# Altium schematic sheet RJ45_Sheet.SchDoc
size 420 x 297 mm; SheetNumber: 6; SheetTotal: 32
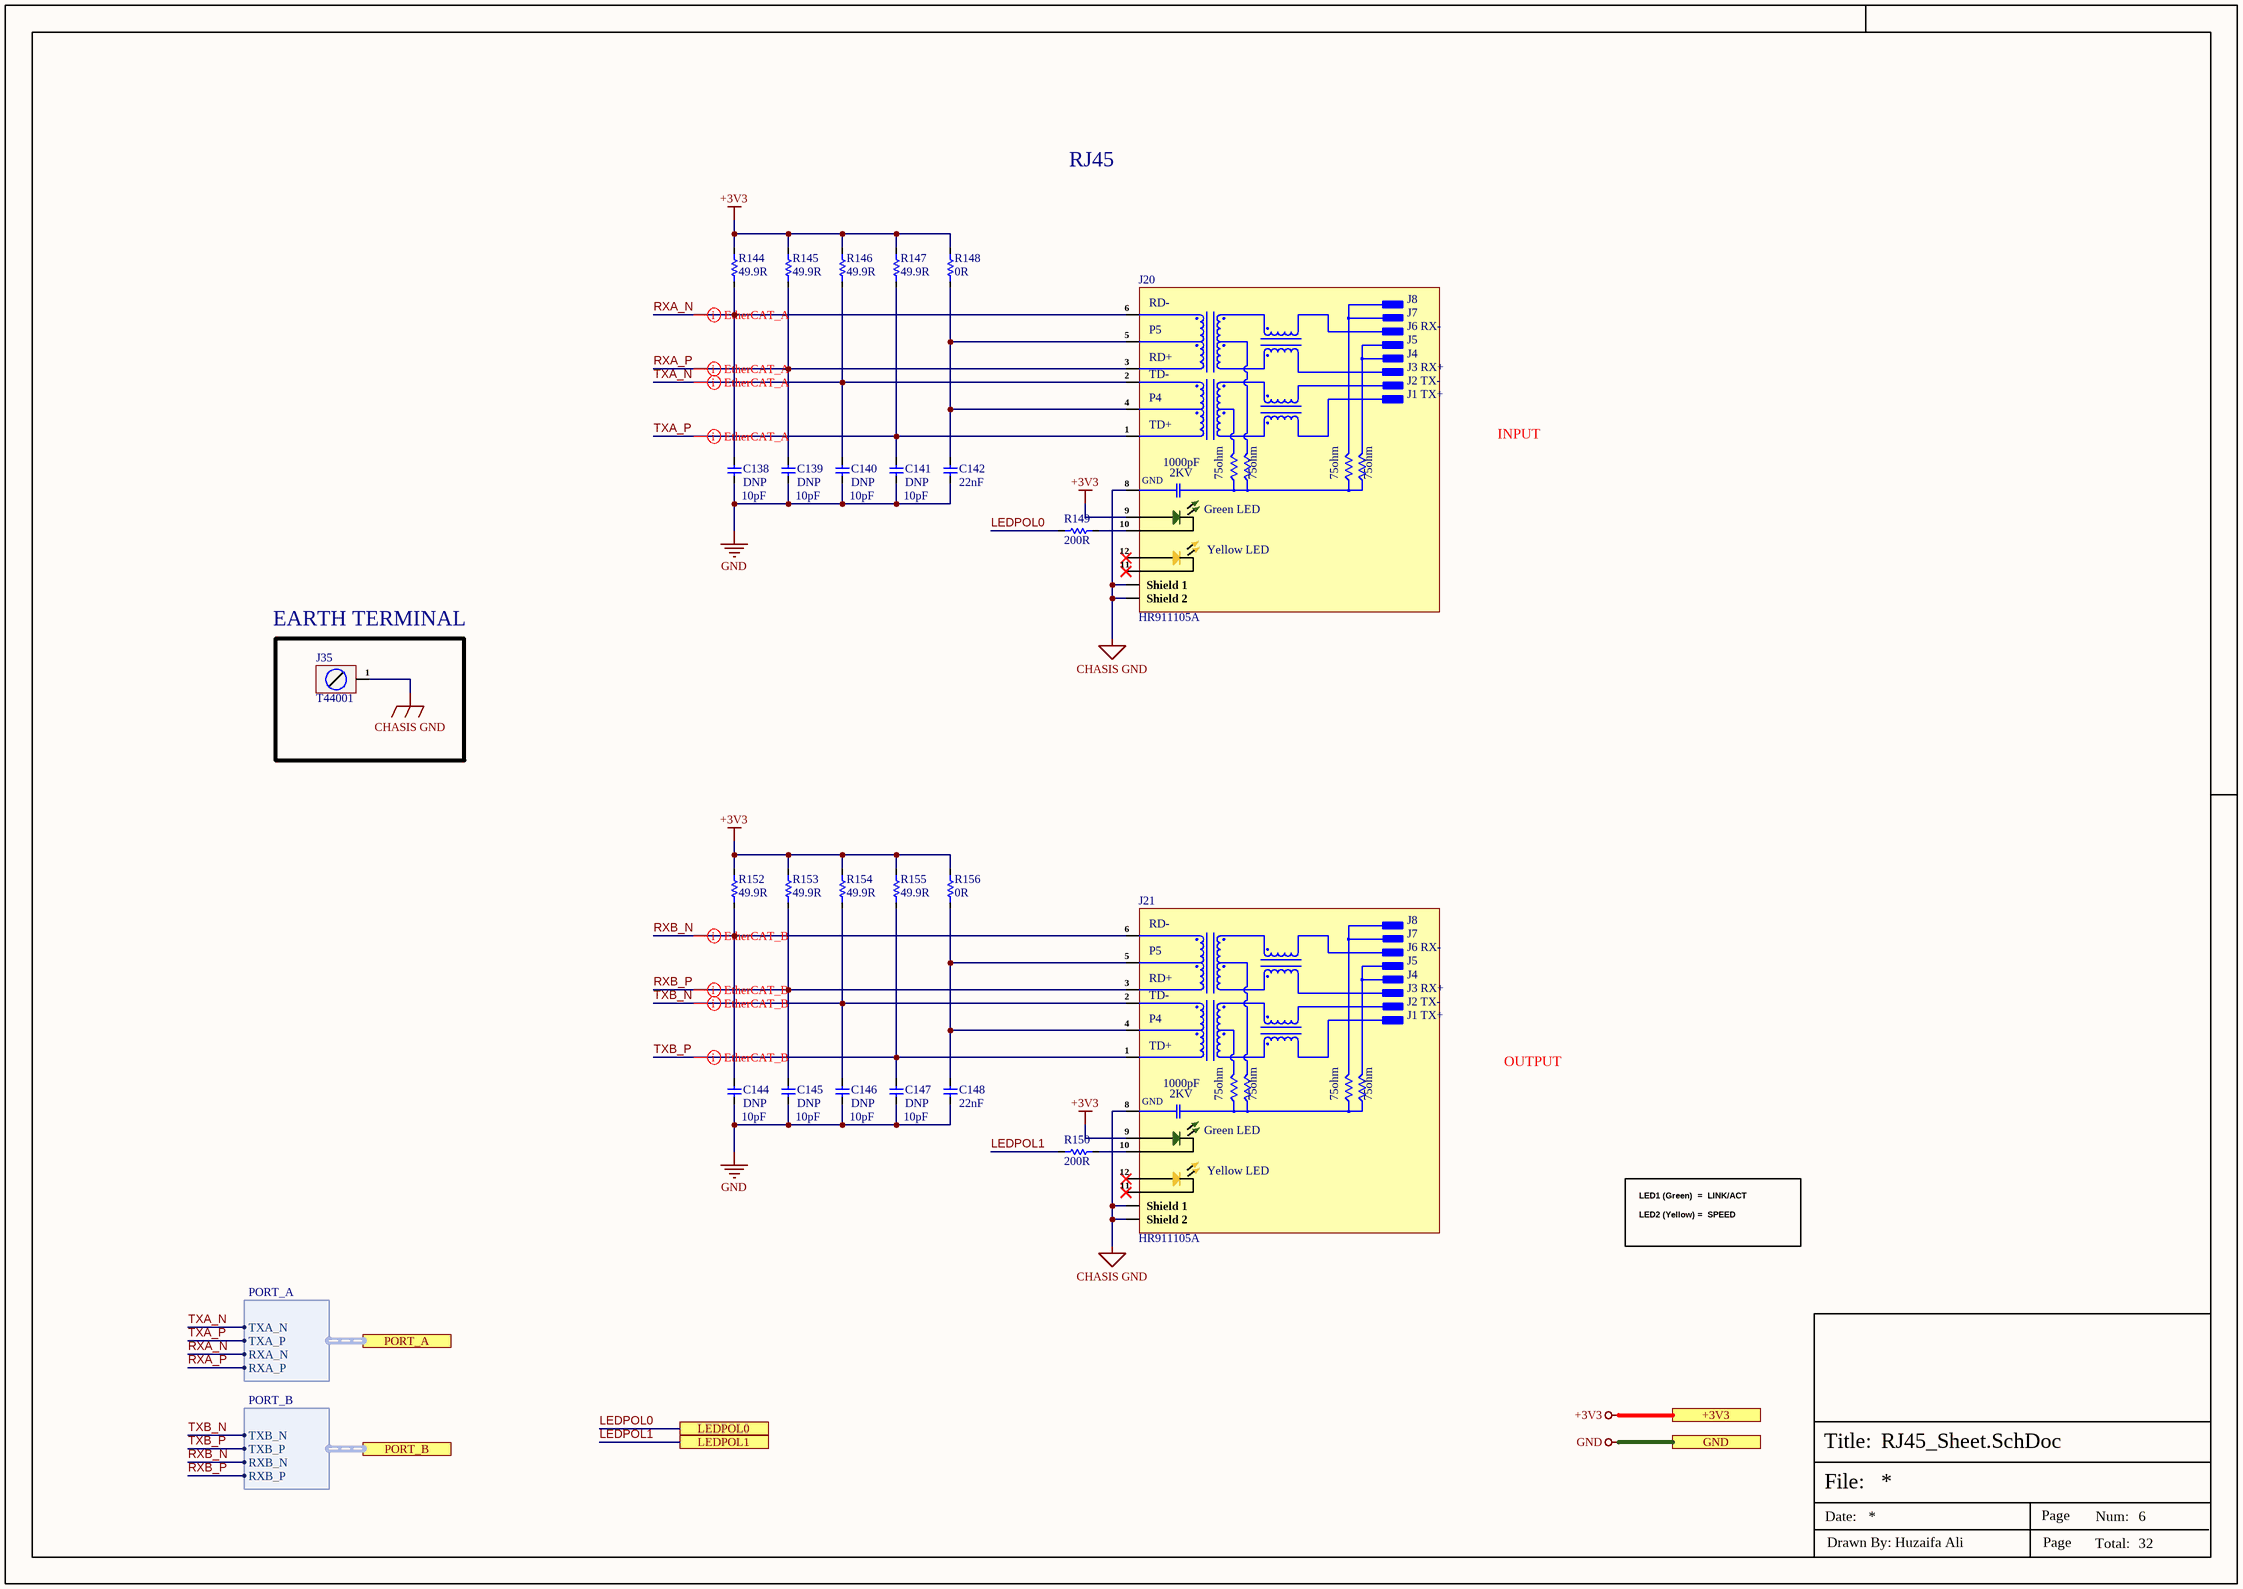
[diagram p0: RJ45_Sheet.SchDoc]

## Parts
C138  DNP  [Cap-0402]
C139  DNP  [Cap-0402]
C140  DNP  [Cap-0402]
C141  DNP  [Cap-0402]
C142  22nF  [Cap-0402]
C144  DNP  [Cap-0402]
C145  DNP  [Cap-0402]
C146  DNP  [Cap-0402]
C147  DNP  [Cap-0402]
C148  22nF  [Cap-0402]
J20  HR911105A  [HR911105A]
J21  HR911105A  [HR911105A]
J35  T44001  [T44001]
R144  49.9R  [Res-0603]
R145  49.9R  [Res-0603]
R146  49.9R  [Res-0603]
R147  49.9R  [Res-0603]
R148  0R  [Res-0402]
R149  200R  [Res-0402]
R150  200R  [Res-0402]
R152  49.9R  [Res-0603]
R153  49.9R  [Res-0603]
R154  49.9R  [Res-0603]
R155  49.9R  [Res-0603]
R156  0R  [Res-0402]

## Ports
+3V3 (see Top_Sheet[2C], CAN_Sheet[5D], Connector_Sheet[5D], Controller_Sheet[5D], Encoder_Sheet1[5D], Encoder_Sheet2[5D], Encoder_Sheet3[5D], Encoder_Sheet4[5D], EtherCAT_Sheet[5D], Motor_Driver_Sheet1[5D], Motor_Driver_Sheet2[5D], Motor_Driver_Sheet3[5D], Motor_Driver_Sheet4[5D], Power_Sheet[5D], RS485_RS232_Sheet[3D], Sec_Controller_Sheet1[5D], Sec_Controller_Sheet2[5D], Sec_Controller_Sheet3[5D], Sec_Controller_Sheet4[5D]), GND (see Top_Sheet[2C], CAN_Sheet[5D], Connector_Sheet[5D], Controller_Sheet[5D], DIO_1[5D], DIO_2[5D], DIO_3[5D], DIO_4[5D], Encoder_Sheet1[5D], Encoder_Sheet2[5D], Encoder_Sheet3[5D], Encoder_Sheet4[5D], EtherCAT_Sheet[5D], MOSFET_Driver_Sheet1[5D], MOSFET_Driver_Sheet2[5D], MOSFET_Driver_Sheet3[5D], MOSFET_Driver_Sheet4[5D], Motor_Driver_Sheet1[5D], Motor_Driver_Sheet2[5D], Motor_Driver_Sheet3[5D], Motor_Driver_Sheet4[5D], Power_Sheet[5D], RS485_RS232_Sheet[3D], Sec_Controller_Sheet1[5D], Sec_Controller_Sheet2[5D], Sec_Controller_Sheet3[5D], Sec_Controller_Sheet4[5D]), LEDPOL0 (see Top_Sheet[2D], EtherCAT_Sheet[1D]), LEDPOL1 (see Top_Sheet[2D], EtherCAT_Sheet[1D]), PORT_A (harness PORT_A, see Top_Sheet[2D], EtherCAT_Sheet[2D]), PORT_B (harness PORT_B, see Top_Sheet[2D], EtherCAT_Sheet[2D])

## Harnesses
PORT_A: TXA_N, TXA_P, RXA_N, RXA_P
PORT_B: TXB_N, TXB_P, RXB_N, RXB_P

## Nets
+3V3: J20.9(ANODE) J21.9(ANODE) R144.2 R145.2 R146.2 R147.2 R148.2 R152.2 R153.2 R154.2 R155.2 R156.2 ; port +3V3
CHASIS GND: J20.8(GND) J20.Shield_1 J20.Shield_2 J21.8(GND) J21.Shield_1 J21.Shield_2 J35.1
GND: C138.1 C139.1 C140.1 C141.1 C142.1 C144.1 C145.1 C146.1 C147.1 C148.1 ; port GND
LEDPOL0: R149.1 ; port LEDPOL0
LEDPOL1: R150.1 ; port LEDPOL1
RXA_N: C138.2 J20.6(RD-) R144.1 ; port PORT_A.RXA_N
RXA_P: C139.2 J20.3(RD+) R145.1 ; port PORT_A.RXA_P
RXB_N: C144.2 J21.6(RD-) R152.1 ; port PORT_B.RXB_N
RXB_P: C145.2 J21.3(RD+) R153.1 ; port PORT_B.RXB_P
TXA_N: C140.2 J20.2(TD-) R146.1 ; port PORT_A.TXA_N
TXA_P: C141.2 J20.1(TD+) R147.1 ; port PORT_A.TXA_P
TXB_N: C146.2 J21.2(TD-) R154.1 ; port PORT_B.TXB_N
TXB_P: C147.2 J21.1(TD+) R155.1 ; port PORT_B.TXB_P
NetC142_2: C142.2 J20.4(P4) J20.5(P5) R148.1
NetC148_2: C148.2 J21.4(P4) J21.5(P5) R156.1
NetJ20_10: J20.10(CATHODE) R149.2
NetJ21_10: J21.10(CATHODE) R150.2

Not connected (* = marked no-connect by the designer): J20 11(CATHODE)* 12(ANODE_)*; J21 11(CATHODE)* 12(ANODE_)*

## Layout directives
differential pair; differential pair class EtherCAT_B_Lines; net class EtherCAT_B; rule Matched Net Lengths [Tolerance = 25.4mil]; rule Impedance Constraint [Min = 85.00    Max = 95.00    ]: RXB_N, RXB_P, TXB_N, TXB_P
differential pair; differential pair class EtherCAT_A_Lines; net class EtherCAT_A; rule Matched Net Lengths [Tolerance = 25.4mil]; rule Impedance Constraint [Min = 85.00    Max = 95.00    ]: RXA_N, RXA_P, TXA_N, TXA_P

## Notes on the sheet
- RJ45
- INPUT
- 10pF
- (near J35) EARTH TERMINAL
- OUTPUT
- LED1 (Green)  =  LINK/ACT
  LED2 (Yellow) =  SPEED
- File:
- Title:
- Date:
- Page
- Num:
- Total:
- Drawn By: Huzaifa Ali
- (in symbol HR911105A) J8; J7; J6 RX-; J5; J4; J3 RX+; J2 TX-; J1 TX+; 1000pF; 2KV; 75ohm; Green LED; Yellow LED

## Library data of the parts
C138-C141 C144-C147 = GRM1555C1H100JA01D: CAP CER 10PF 50V C0G/NP0 0402; Manufacturer: Murata; Material: Ceramic; Dielectric: C0G; Tolerance: 5%; Item Type: Capacitor; Supplier: Arrow Electronics; Supplier Part Number: GRM1555C1H100JA01D; Manufacturer Part Number: GRM1555C1H100JA01D; RoHS: Yes; Category: Ceramic Capacitors; Stock: 3860000; Pricing: 10000=0.0034, 50000=0.0027, 100000=0.0023, 250000=0.0021 (USD); Mounting Technology: Surface Mount; Case/Package: 0402; Case Code (Metric): 1005; Case Code (Imperial): 0402; Min Operating Temperature: -55°C; Max Operating Temperature: 125°C; Value: 10pF; Voltage Rating: 50V; Packaging: Tape and Reel; Package Quantity: 1; Voltage Rating (DC): 50V; Termination: SMD/SMT; Series: GRM; Voltage: 50V; Construction: Flat; Length: 1mm; Width: 0.02inch; Height: 0.5mm; Depth: 0.5mm; Thickness: 0.022inch; Radiation Hardening: No; RoHS Compliant: Yes; Lead Free: Lead Free; Reach SVHC Compliant: No; ComponentLink1URL: https://datasheet.ciiva.com/2989/product-2989280.pdf?src-supplier=Avnet; ComponentLink1Description: https://datasheet.ciiva.com/2989/product-2989280.pdf?src-supplier=Avnet; ComponentLink2URL: https://datasheet.ciiva.com/18184/getdatasheetpartid-307234-18184164.pdf?src-supplier=Verical; ComponentLink2Description: https://datasheet.ciiva.com/18184/getdatasheetpartid-307234-18184164.pdf?src-supplier=Verical; ComponentLink3URL: https://datasheet.ciiva.com/29200/453545-da-01-en-vs-kondensator-0402-29200107.pdf?src-supplier=Conrad; ComponentLink3Description: https://datasheet.ciiva.com/29200/453545-da-01-en-vs-kondensator-0402-29200107.pdf?src-supplier=Conrad; ComponentLink4URL: https://datasheet.ciiva.com/7828/1666664-7828812.pdf?src-supplier=Element14; ComponentLink4Description: https://datasheet.ciiva.com/7828/1666664-7828812.pdf?src-supplier=Element14; ComponentLink5URL: https://datasheet.ciiva.com/6271/partnumbering-e-01-6271159.pdf?src-supplier=Digi-Key; ComponentLink5Description: https://datasheet.ciiva.com/6271/partnumbering-e-01-6271159.pdf?src-supplier=Digi-Key; ComponentLink6URL: https://datasheet.ciiva.com/6271/partnumbering-e-01-6271158.pdf?src-supplier=Digi-Key; ComponentLink6Description: https://datasheet.ciiva.com/6271/partnumbering-e-01-6271158.pdf?src-supplier=Digi-Key; ComponentLink7URL: https://datasheet.ciiva.com/6271/partnumbering-e-01-6271068.pdf?src-supplier=Digi-Key; ComponentLink7Description: https://datasheet.ciiva.com/6271/partnumbering-e-01-6271068.pdf?src-supplier=Digi-Key; LCSC Part Number: C76946
C142 C148 = CC0402JRX7R7BB223: CAP CER 0.022UF 16V X7R 0402; Manufacturer: Yageo; Tolerance: 5%; Item Type: Capacitor; Supplier: Digikey; Supplier Part Number: 311-3758-1-ND; Manufacturer Part Number: CC0402JRX7R7BB223; RoHS: Yes; Category: Ceramic Capacitors; Stock: 4203; Pricing: 1=0.1, 10=0.033, 50=0.0192, 100=0.0149, 500=0.0112, 1000=0.0088, 2500=0.008, 5000=0.00736 (USD); Mounting Technology: Surface Mount; Case/Package: 0402; Case Code (Imperial): 0402; Case Code (Metric): 1005; Weight: 2.3E-05oz; Min Operating Temperature: -55°C; Max Operating Temperature: 125°C; Value: 22nF; Packaging: Tape and Reel; Voltage Rating: 16V; Voltage Rating (DC): 16V; Dielectric: X7R; Termination: SMD/SMT; Series: CC; Length: 0.039inch; Width: 0.5mm; Thickness: 0.022inch; RoHS Compliant: Yes; Halogen Free: 5694HalogenFree; Lead Free: 5697LeadFree; ComponentLink1URL: https://datasheet.ciiva.com/13264/upy-gphc-x7r-6-3v-to-50v-8-12304-13264039.pdf?src-supplier=Mouser; ComponentLink1Description: https://datasheet.ciiva.com/13264/upy-gphc-x7r-6-3v-to-50v-8-12304-13264039.pdf?src-supplier=Mouser; LCSC Part Number: C541459
J20 J21 = HR911105A: RJ45 RJReceptacle 1 WithLED Plugin Ethernet Connectors/Modular Connectors (RJ45 RJ11) ROHS; Manufacturer: HANRUN; Item Type: RJ45 Connector; Manufacturer Part Number: HR911105A; Package: Plugin; LCSC Part Number: C12074; ComponentLink1Description: LCSC; ComponentLink1URL: https://www.lcsc.com/product-detail/Ethernet-Connectors-Modular-Connectors-RJ45-RJ11_HANRUN-Zhongshan-HanRun-Elec-HR911105A_C12074.html
J35 = T44001: M4 Plugin PCB Welding Terminal ROHS; Manufacturer: XFCN; Manufacturer Part Number: T44001; Package: Plugin; ComponentLink1Description: LCSC; ComponentLink1URL: *
R144-R147 R152-R155 = RC0603FR-0749R9L: RES 49.9 OHM 1% 1/10W 0603; Manufacturer: Yageo; Temperature Coefficient: 100ppm/°C; Voltage Rating (DC): 50V; Power Rating: 100mW; Item Type: Resistor; Supplier 1: Arrow Electronics; Manufacturer Part Number: RC0603FR-0749R9L; RoHS: Yes; Category: Chip SMD Resistors; Stock 1: 2075000; Pricing 1: 5000=0.00280 (USD); Case/Package: 0603; Number of Pins: 2; Case Code (Imperial): 0603; Case Code (Metric): 1608; Size Code: 0603; Min Operating Temperature: -55°C; Max Operating Temperature: 155°C; Tolerance: 1%; Resistance: 49.9R; Resistor Type: Thick Film; Packaging: Tape and Reel; Voltage Rating: 50V; Termination: SMD/SMT; Features: Moisture Resistant; Series: RC; Max Power Dissipation: 100mW; Number of Terminations: 2; Construction: Rectangular; Resistance Tolerance: 1%; Technology: THICK FILM; Length: 1.6mm; Height: 0.45mm; Depth: 0.8mm; Lead Free: Lead Free; REACH SVHC: No SVHC; Military Standard: Not; RoHS Compliant: Yes; ComponentLink1URL: https://datasheet.ciiva.com/11808/0900766b80f96399-11808223.pdf?src-supplier=RSComponents; ComponentLink1Description: https://datasheet.ciiva.com/11808/0900766b80f96399-11808223.pdf?src-supplier=RSComponents; ComponentLink2URL: https://datasheet.ciiva.com/22747/443971-22747527.pdf?src-supplier=Element14; ComponentLink2Description: https://datasheet.ciiva.com/22747/443971-22747527.pdf?src-supplier=Element14; ComponentLink3URL: https://datasheet.ciiva.com/15189/getdatasheetpartid-325421-15189750.pdf?src-supplier=Verical; ComponentLink3Description: https://datasheet.ciiva.com/15189/getdatasheetpartid-325421-15189750.pdf?src-supplier=Verical; Supplier Part Number 1: RC0603FR-0749R9L; LCSC Part Number: C114625
R148 R156 = AC0402FR-070RL: RESISTOR 0402 JUMPER ZERO OHM; Manufacturer: Yageo; Voltage Rating: 50V; Power Rating: 62.5mW; Tolerance: 1%; Temperature Coefficient: 200ppm/°C; Supplier: Digi-Key; Supplier Part Number: 13-AC0402FR-070RLDKR-ND; Manufacturer Part Number: AC0402FR-070RL; RoHS: Yes; Category: Chip SMD Resistors; Stock: 337140; Pricing: 1=0.1, 10=0.017, 25=0.0132, 50=0.01, 100=0.0071, 250=0.00568, 500=0.00454, 1000=0.00335, 5000=0.0024 (USD); Case/Package: 0402; Case Code (Imperial): 0402; Case Code (Metric): 1005; Min Operating Temperature: -55°C; Max Operating Temperature: 155°C; Value: 0R; Packaging: Tape and Reel; Termination: SMD/SMT; Series: AC; Height: 370um; ComponentLink1URL: https://datasheet.ciiva.com/12656/pyu-ac-51-rohs-l-2-12656734.pdf?src-supplier=Mouser; ComponentLink1Description: https://datasheet.ciiva.com/12656/pyu-ac-51-rohs-l-2-12656734.pdf?src-supplier=Mouser; LCSC Part Number: C226739; Item Type: Resistor; ComponentLink2Description: LCSC; ComponentLink2URL: https://www.lcsc.com/product-detail/Chip-Resistor-Surface-Mount_YAGEO-AC0402FR-070RL_C226739.html
R149 R150 = RC0402FR-07200RL: RES 200 OHM 1% 1/16W 0402; Manufacturer: Yageo; Temperature Coefficient: 100ppm/°C; Power Rating: 63mW; Voltage Rating (DC): 50V; Supplier 1: Digi-Key; Manufacturer Part Number: RC0402FR-07200RL; RoHS: Yes; Category: Chip SMD Resistors; Stock 1: 19778; Pricing 1: 1=0.10000, 10=0.01600, 100=0.00660, 1000=0.00299, 2500=0.00259, 5000=0.00214 (USD); Case/Package: 0402; Case Code (Metric): 1005; Case Code (Imperial): 0402; Size Code: 0402; Min Operating Temperature: -55°C; Max Operating Temperature: 155°C; Tolerance: 1%; Resistance: 200R; Resistor Type: Thick Film; Packaging: Tape and Reel; Voltage Rating: 50V; Package Quantity: 1; Number of Terminations: 2; Termination: SMD/SMT; Max Power Dissipation: 63mW; Features: Moisture Resistant; Series: RC; Construction: Rectangular; Resistance Tolerance: 1%; Length: 1mm; Width: 0.02inch; Height: 0.016inch; Depth: 0.5mm; REACH SVHC: No SVHC; Lead Free: Lead Free; RoHS Compliant: Yes; Military Standard: Not; ComponentLink1URL: https://datasheet.ciiva.com/2553/pyu-r-int-thick-7-2553232.pdf?src-supplier=Digi-Key; ComponentLink1Description: https://datasheet.ciiva.com/2553/pyu-r-int-thick-7-2553232.pdf?src-supplier=Digi-Key; ComponentLink2URL: https://datasheet.ciiva.com/7983/1018594-7983509.pdf?src-supplier=Element14; ComponentLink2Description: https://datasheet.ciiva.com/7983/1018594-7983509.pdf?src-supplier=Element14; ComponentLink3URL: https://datasheet.ciiva.com/16804/pyu-rc0402-51-rohs-l-6-r-16804406.pdf?src-supplier=Future+Electronics; ComponentLink3Description: https://datasheet.ciiva.com/16804/pyu-rc0402-51-rohs-l-6-r-16804406.pdf?src-supplier=Future+Electronics; ComponentLink4URL: https://datasheet.ciiva.com/15189/getdatasheetpartid-331152-15189383.pdf?src-supplier=Verical; ComponentLink4Description: https://datasheet.ciiva.com/15189/getdatasheetpartid-331152-15189383.pdf?src-supplier=Verical; ComponentLink5URL: https://datasheet.ciiva.com/7849/1018594-7849898.pdf?src-supplier=Element14; ComponentLink5Description: https://datasheet.ciiva.com/7849/1018594-7849898.pdf?src-supplier=Element14; ComponentLink6URL: https://datasheet.ciiva.com/5562/pyu-rc0402-51-rohs-l-6-r-8721-5562539.pdf?src-supplier=Mouser; ComponentLink6Description: https://datasheet.ciiva.com/5562/pyu-rc0402-51-rohs-l-6-r-8721-5562539.pdf?src-supplier=Mouser; ComponentLink7URL: https://datasheet.ciiva.com/7849/1018594-7849899.pdf?src-supplier=Element14; ComponentLink7Description: https://datasheet.ciiva.com/7849/1018594-7849899.pdf?src-supplier=Element14; ComponentLink8URL: https://datasheet.ciiva.com/2553/pyu-r-int-thick-7-2553230.pdf?src-supplier=Digi-Key; ComponentLink8Description: https://datasheet.ciiva.com/2553/pyu-r-int-thick-7-2553230.pdf?src-supplier=Digi-Key; ComponentLink9URL: https://datasheet.ciiva.com/2553/pyu-r-int-thick-7-2553231.pdf?src-supplier=Digi-Key; ComponentLink9Description: https://datasheet.ciiva.com/2553/pyu-r-int-thick-7-2553231.pdf?src-supplier=Digi-Key; Supplier Part Number 1: 311-200LRCT-ND; LCSC Part Number: C114764